# Altium schematic sheet Status_LED.SchDoc
size A
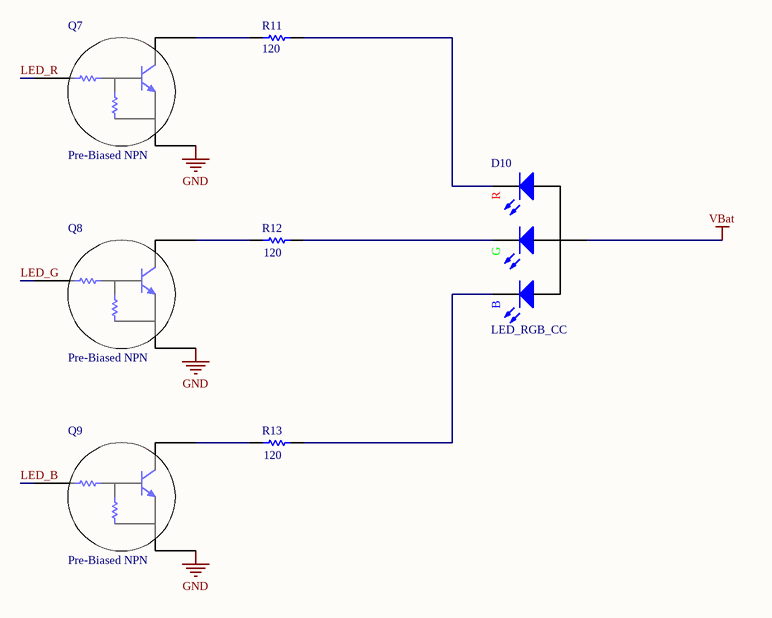
[diagram p0: Status_LED.SchDoc]

## Parts
D10  LED_RGB_CC  [SM1210RGB]
Q7  Pre-Biased NPN  [SOT-416]
Q8  Pre-Biased NPN  [SOT-416]
Q9  Pre-Biased NPN  [SOT-416]
R11  value 120  [0603]  (hidden comment: Resistor)
R12  value 120  [0603]  (hidden comment: Resistor)
R13  value 120  [0603]  (hidden comment: Resistor)

## Nets
GND: Q7.2 Q8.2 Q9.2
VBat: D10.1
LED_B: Q9.1
LED_G: Q8.1
LED_R: Q7.1
NetD10_2: D10.2 R11.2
NetD10_3: D10.3 R12.2
NetD10_4: D10.4 R13.2
NetQ7_3: Q7.3 R11.1
NetQ8_3: Q8.3 R12.1
NetQ9_3: Q9.3 R13.1

## Notes on the sheet
- (in symbol LED_RGB_CC) R; G; B

## Library data of the parts
D10 = LED_RGB_CC: RGB LED Common Cathode
Q7-Q9 = Pre-Biased NPN: Manufacturer Part No: DTD743EETL; Vendor Part No: DTD743EETLTR-ND; Vendor: Digikey
R11-R13 = Resistor: Published: 8-Jun-2000; LatestRevisionDate: 17-Jul-2002; LatestRevisionNote: Re-released for DXP Platform.; PackageReference: AXIAL-0.3; Publisher: Altium Limited